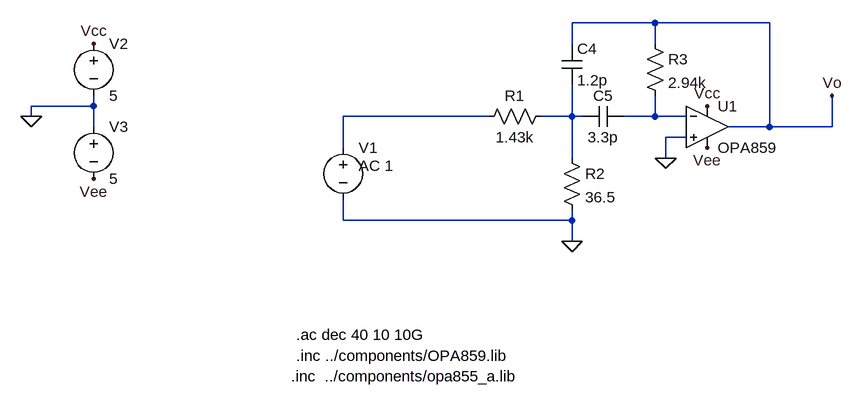
[diagram p0: schematic FilterTesting.asc]
FilterTesting.asc, the LTspice schematic file:
Version 4
SHEET 1 1776 680
WIRE 512 -304 384 -304
WIRE 688 -304 512 -304
WIRE 384 -272 384 -304
WIRE 512 -272 512 -304
WIRE -352 -176 -352 -192
WIRE -352 -176 -448 -176
WIRE -448 -160 -448 -176
WIRE 256 -160 32 -160
WIRE 384 -160 384 -208
WIRE 384 -160 336 -160
WIRE 400 -160 384 -160
WIRE 512 -160 512 -192
WIRE 512 -160 464 -160
WIRE 560 -160 512 -160
WIRE -352 -144 -352 -176
WIRE 688 -144 688 -304
WIRE 688 -144 624 -144
WIRE 784 -144 784 -192
WIRE 784 -144 688 -144
WIRE 560 -128 528 -128
WIRE 32 -112 32 -160
WIRE 384 -96 384 -160
WIRE 528 -96 528 -128
WIRE 32 0 32 -32
WIRE 384 0 384 -16
WIRE 384 0 32 0
WIRE 384 32 384 0
FLAG 528 -96 0
FLAG 592 -176 Vcc
FLAG 592 -112 Vee
FLAG 384 32 0
FLAG 784 -192 Vo
FLAG -448 -160 0
FLAG -352 -272 Vcc
FLAG -352 -64 Vee
SYMBOL voltage 32 -128 R0
WINDOW 123 24 44 Left 2
WINDOW 39 0 0 Left 0
SYMATTR InstName V1
SYMATTR Value ""
SYMATTR Value2 AC 1
SYMBOL OpAmps\\opamp2 592 -208 R0
SYMATTR InstName U1
SYMATTR Value OPA859
SYMBOL res 240 -144 R270
WINDOW 0 32 56 VTop 2
WINDOW 3 0 56 VBottom 2
SYMATTR InstName R1
SYMATTR Value 1.43k
SYMBOL res 368 -112 R0
SYMATTR InstName R2
SYMATTR Value 36.5
SYMBOL cap 368 -272 R0
SYMATTR InstName C4
SYMATTR Value 1.2p
SYMBOL cap 464 -176 R90
WINDOW 0 0 32 VBottom 2
WINDOW 3 32 32 VTop 2
SYMATTR InstName C5
SYMATTR Value 3.3p
SYMBOL res 496 -288 R0
SYMATTR InstName R3
SYMATTR Value 2.94k
SYMBOL voltage -352 -288 R0
WINDOW 123 0 0 Left 0
WINDOW 39 0 0 Left 0
SYMATTR InstName V2
SYMATTR Value 5
SYMBOL voltage -352 -160 R0
WINDOW 123 0 0 Left 0
WINDOW 39 0 0 Left 0
SYMATTR InstName V3
SYMATTR Value 5
TEXT -40 176 Left 2 !.ac dec 40 10 10G
TEXT -48 240 Left 2 !.inc  ../components/opa855_a.lib
TEXT -40 208 Left 2 !.inc ../components/OPA859.lib

The netlist it stands for:
* FilterTesting.asc
V1 N001 0 AC 1
XU1 0 N003 Vcc Vee Vo OPA859  ; pins In+ In- V+ V- OUT
R1 N001 N002 1.43k
R2 N002 0 36.5
C4 Vo N002 1.2p
C5 N003 N002 3.3p
R3 Vo N003 2.94k
V2 Vcc 0 5
V3 0 Vee 5
.ac dec 40 10 10G
.inc  ../components/opa855_a.lib
.inc ../components/OPA859.lib
.backanno
.end